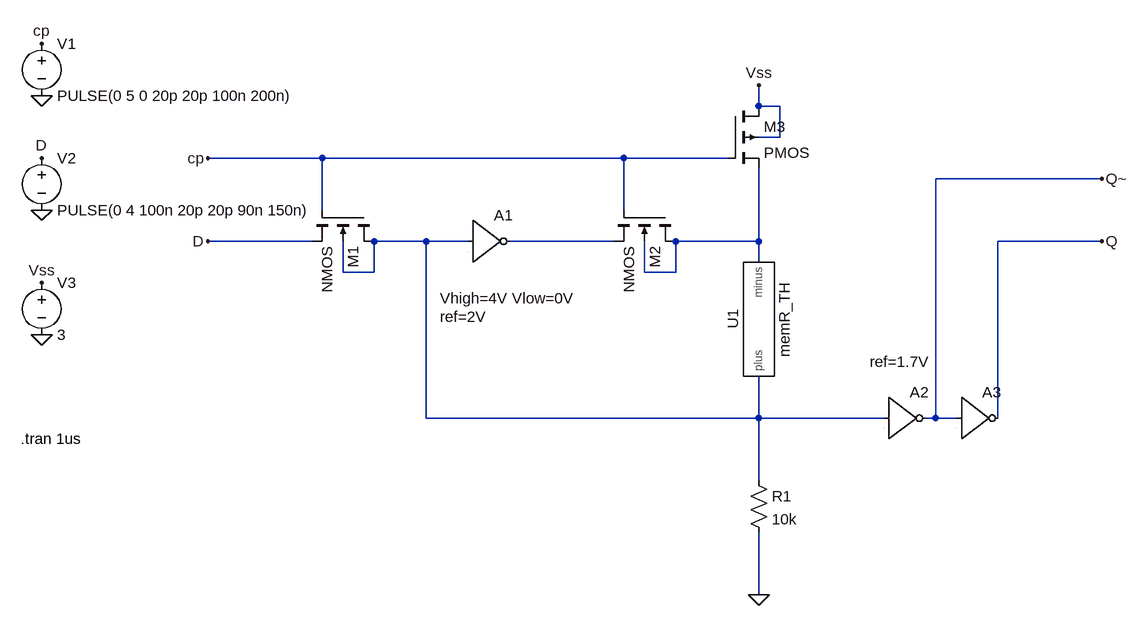
[diagram p0: schematic D触发器.asc]
D触发器.asc, the LTspice schematic file:
Version 4
SHEET 1 2436 756
WIRE 688 -16 688 -48
WIRE 720 -16 688 -16
WIRE 720 32 720 -16
WIRE 720 32 688 32
WIRE 16 64 -160 64
WIRE 480 64 16 64
WIRE 640 64 480 64
WIRE 1216 96 960 96
WIRE 16 144 16 64
WIRE 480 144 480 64
WIRE 0 192 -160 192
WIRE 176 192 96 192
WIRE 240 192 176 192
WIRE 464 192 304 192
WIRE 688 192 688 80
WIRE 688 192 560 192
WIRE 1216 192 1056 192
WIRE 688 224 688 192
WIRE 48 240 48 192
WIRE 96 240 96 192
WIRE 96 240 48 240
WIRE 512 240 512 192
WIRE 560 240 560 192
WIRE 560 240 512 240
WIRE 176 464 176 192
WIRE 688 464 688 400
WIRE 688 464 176 464
WIRE 880 464 688 464
WIRE 960 464 960 96
WIRE 960 464 944 464
WIRE 992 464 960 464
WIRE 1056 464 1056 192
WIRE 688 560 688 464
WIRE 688 736 688 640
FLAG -160 64 cp
FLAG -160 192 D
FLAG 688 -48 Vss
FLAG -416 336 0
FLAG -416 144 0
FLAG -416 -32 0
FLAG -416 -112 cp
FLAG -416 64 D
FLAG -416 256 Vss
FLAG 688 736 0
FLAG 1216 192 Q
FLAG 1216 96 Q~
SYMBOL Digital\\inv 240 128 R0
WINDOW 3 -43 152 Left 2
WINDOW 123 -43 180 Left 2
SYMATTR InstName A1
SYMATTR Value Vhigh=4V Vlow=0V
SYMATTR Value2 ref=2V
SYMBOL memR_TH 688 320 R270
SYMATTR InstName U1
SYMBOL Digital\\inv 880 400 R0
WINDOW 3 8 60 Invisible 2
WINDOW 123 -21 -23 Left 2
SYMATTR InstName A2
SYMATTR Value Vhigh=4V Vlow=0V
SYMATTR Value2 ref=1.7V
SYMBOL Digital\\inv 992 400 R0
WINDOW 3 8 104 Invisible 2
SYMATTR InstName A3
SYMATTR Value Vhigh=4V Vlow=0V
SYMBOL voltage -416 -128 R0
WINDOW 123 0 0 Left 0
WINDOW 39 0 0 Left 0
SYMATTR InstName V1
SYMATTR Value PULSE(0 5 0 20p 20p 100n 200n)
SYMBOL voltage -416 48 R0
WINDOW 123 0 0 Left 0
WINDOW 39 0 0 Left 0
SYMATTR InstName V2
SYMATTR Value PULSE(0 4 100n 20p 20p 90n 150n)
SYMBOL voltage -416 240 R0
WINDOW 123 0 0 Left 0
WINDOW 39 0 0 Left 0
SYMATTR InstName V3
SYMATTR Value 3
SYMBOL res 672 544 R0
SYMATTR InstName R1
SYMATTR Value 10k
SYMBOL nmos4 96 144 R90
SYMATTR InstName M1
SYMBOL nmos4 560 144 R90
SYMATTR InstName M2
SYMBOL pmos4 640 -16 R0
SYMATTR InstName M3
TEXT -448 496 Left 2 !.tran 1us

The netlist it stands for:
* D触发器.asc
A1 N001 0 0 0 0 N002 0 0 BUF Vhigh=4V Vlow=0V ref=2V
XU1 N001 N003 memR_TH  ; pins plus minus
A2 N001 0 0 0 0 Q~ 0 0 BUF Vhigh=4V Vlow=0V ref=1.7V
A3 Q~ 0 0 0 0 Q 0 0 BUF Vhigh=4V Vlow=0V
V1 cp 0 PULSE(0 5 0 20p 20p 100n 200n)
V2 D 0 PULSE(0 4 100n 20p 20p 90n 150n)
V3 Vss 0 3
R1 N001 0 10k
M1 N001 cp D N001 NMOS
M2 N003 cp N002 N003 NMOS
M3 Vss cp N003 Vss PMOS
.model NMOS NMOS
.model PMOS PMOS
.lib standard.mos
.tran 1us
.lib C:\Users\yv236\Documents\LTspice\memR_TH.sub
.backanno
.end